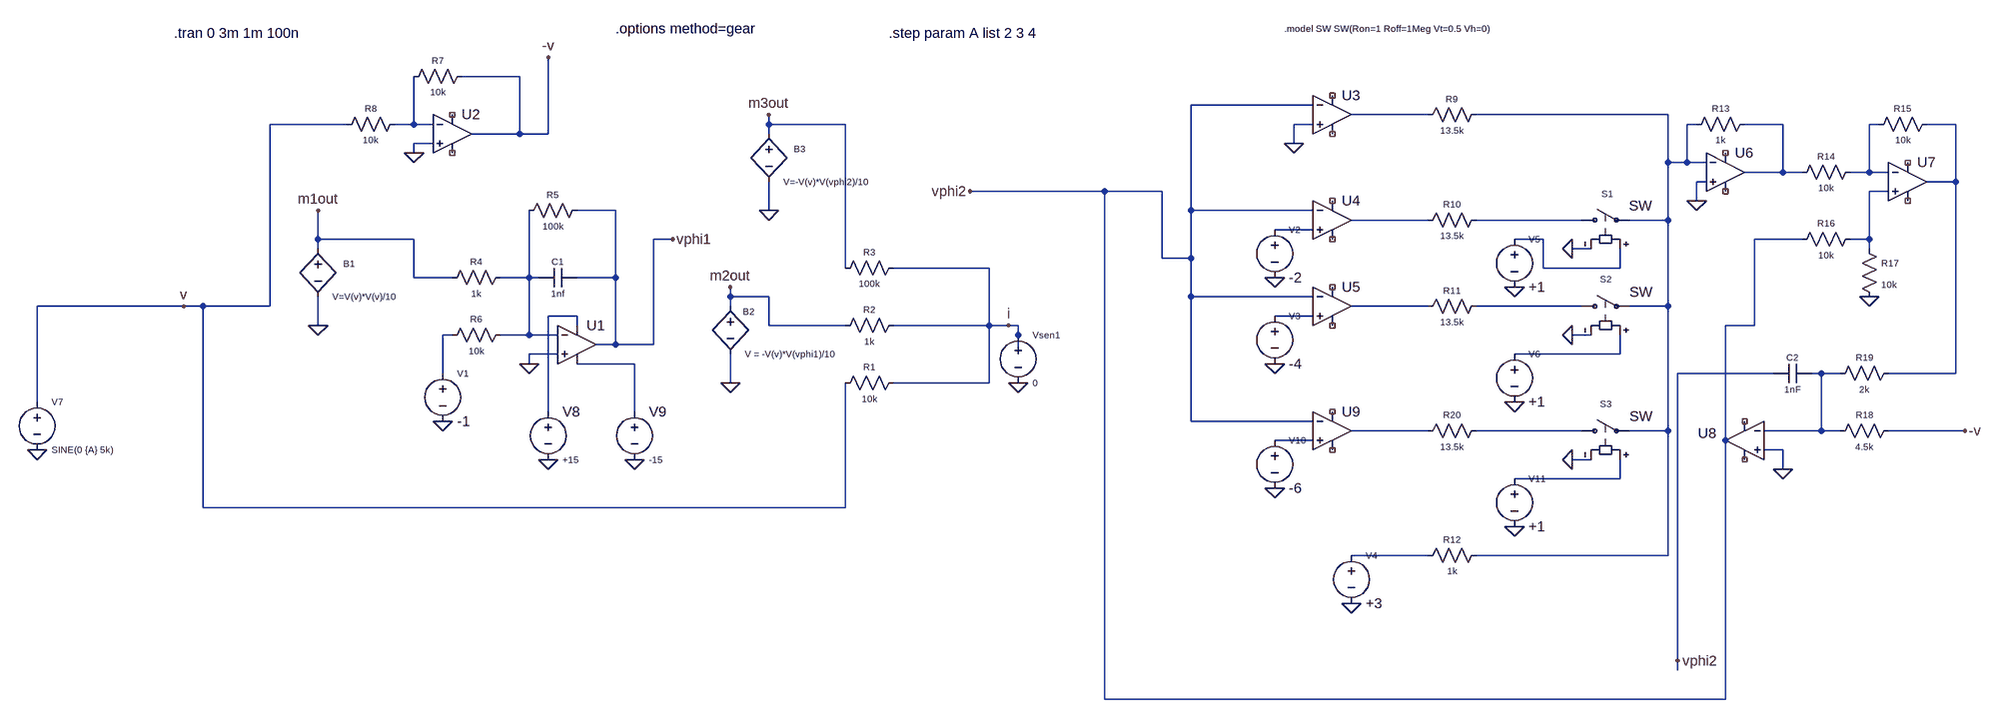
[diagram p0: schematic second_order_memregister.asc]
second_order_memregister.asc, the LTspice schematic file:
Version 4.1
SHEET 1 1848 700
WIRE -624 -352 -720 -352
WIRE 720 -304 496 -304
WIRE 912 -288 784 -288
WIRE 1312 -288 992 -288
WIRE -912 -272 -1040 -272
WIRE -800 -272 -800 -352
WIRE -800 -272 -832 -272
WIRE -768 -272 -800 -272
WIRE -208 -272 -208 -288
WIRE -80 -272 -208 -272
WIRE 720 -272 688 -272
WIRE 1360 -272 1344 -272
WIRE 1504 -272 1440 -272
WIRE 1664 -272 1648 -272
WIRE 1792 -272 1744 -272
WIRE -624 -256 -624 -352
WIRE -624 -256 -704 -256
WIRE -576 -256 -576 -384
WIRE -576 -256 -624 -256
WIRE -208 -256 -208 -272
WIRE -768 -240 -800 -240
WIRE 688 -240 688 -272
WIRE -800 -224 -800 -240
WIRE 1312 -208 1312 -288
WIRE 1344 -208 1344 -272
WIRE 1344 -208 1312 -208
WIRE 1376 -208 1344 -208
WIRE 1504 -192 1504 -272
WIRE 1504 -192 1440 -192
WIRE 1536 -192 1504 -192
WIRE 1648 -192 1648 -272
WIRE 1648 -192 1616 -192
WIRE 1680 -192 1648 -192
WIRE 1376 -176 1360 -176
WIRE 1792 -176 1792 -272
WIRE 1792 -176 1744 -176
WIRE 352 -160 128 -160
WIRE 448 -160 352 -160
WIRE 1680 -160 1648 -160
WIRE 1360 -144 1360 -176
WIRE -464 -128 -528 -128
WIRE -208 -128 -208 -176
WIRE 496 -128 496 -304
WIRE 720 -128 496 -128
WIRE 912 -112 784 -112
WIRE 1168 -112 992 -112
WIRE 1312 -112 1312 -208
WIRE 1312 -112 1248 -112
WIRE 720 -96 656 -96
WIRE -960 -80 -960 -128
WIRE -800 -80 -960 -80
WIRE -368 -80 -400 -80
WIRE 1104 -80 1056 -80
WIRE 1536 -80 1456 -80
WIRE 1648 -80 1648 -160
WIRE 1648 -80 1616 -80
WIRE -960 -64 -960 -80
WIRE 1184 -64 1152 -64
WIRE 1648 -64 1648 -80
WIRE 448 -48 448 -160
WIRE 496 -48 496 -128
WIRE 496 -48 448 -48
WIRE -80 -32 -80 -272
WIRE 160 -32 0 -32
WIRE 1104 -32 1104 -80
WIRE 1232 -32 1232 -64
WIRE 1232 -32 1104 -32
WIRE -800 -16 -800 -80
WIRE -736 -16 -800 -16
WIRE -608 -16 -608 -128
WIRE -608 -16 -656 -16
WIRE -592 -16 -608 -16
WIRE -464 -16 -464 -128
WIRE -464 -16 -528 -16
WIRE -272 16 -272 0
WIRE -208 16 -272 16
WIRE 496 16 496 -48
WIRE 720 16 496 16
WIRE -1184 32 -1472 32
WIRE -1152 32 -1184 32
WIRE -1040 32 -1040 -272
WIRE -1040 32 -1152 32
WIRE -272 32 -272 16
WIRE 912 32 784 32
WIRE 1168 32 992 32
WIRE 1312 32 1312 -112
WIRE 1312 32 1248 32
WIRE -528 48 -576 48
WIRE 720 48 656 48
WIRE -960 64 -960 16
WIRE -528 64 -528 48
WIRE -208 64 -208 16
WIRE -80 64 -208 64
WIRE 160 64 160 -32
WIRE 160 64 0 64
WIRE 192 64 160 64
WIRE 208 64 192 64
WIRE 1456 64 1456 -80
WIRE 1456 64 1408 64
WIRE -736 80 -752 80
WIRE -608 80 -608 -16
WIRE -608 80 -656 80
WIRE -560 80 -608 80
WIRE 208 80 208 64
WIRE 1184 80 1152 80
WIRE -464 96 -464 -16
WIRE -464 96 -496 96
WIRE -400 96 -400 -80
WIRE -400 96 -464 96
WIRE -560 112 -608 112
WIRE 208 112 208 80
WIRE 1232 112 1232 80
WIRE 1232 112 1056 112
WIRE -608 128 -608 112
WIRE -432 128 -528 128
WIRE -752 144 -752 80
WIRE 1488 144 1328 144
WIRE 1568 144 1552 144
WIRE 1600 144 1568 144
WIRE 1792 144 1792 -176
WIRE 1792 144 1680 144
WIRE -272 160 -272 112
WIRE -272 160 -288 160
WIRE 160 160 160 64
WIRE 160 160 0 160
WIRE -1472 192 -1472 32
WIRE -576 208 -576 48
WIRE -432 208 -432 128
WIRE 496 224 496 16
WIRE 720 224 496 224
WIRE 912 240 784 240
WIRE 1168 240 992 240
WIRE 1312 240 1312 32
WIRE 1312 240 1248 240
WIRE 1568 240 1568 144
WIRE 1568 240 1472 240
WIRE 1600 240 1568 240
WIRE 1808 240 1680 240
WIRE 720 256 656 256
WIRE 1408 256 1408 64
WIRE 1504 272 1472 272
WIRE 1184 288 1152 288
WIRE 1504 304 1504 272
WIRE 1232 320 1232 288
WIRE 1232 320 1056 320
WIRE -1152 368 -1152 32
WIRE -80 368 -80 160
WIRE -80 368 -1152 368
WIRE 912 448 784 448
WIRE 1312 448 1312 240
WIRE 1312 448 992 448
WIRE 1328 624 1328 144
WIRE 1328 640 1328 624
WIRE 352 688 352 -160
WIRE 1408 688 1408 256
WIRE 1408 688 352 688
FLAG 208 160 0
FLAG -608 128 0
FLAG -800 -224 0
FLAG -368 -80 vphi1
FLAG 128 -160 vphi2
FLAG 688 -240 0
FLAG 1360 -144 0
FLAG 1504 304 0
FLAG 1648 16 0
FLAG 1152 -64 0
FLAG 1152 80 0
FLAG -1184 32 v
FLAG -576 -384 -v
FLAG -752 224 0
FLAG 656 128 0
FLAG 656 -16 0
FLAG 784 528 0
FLAG 1056 0 0
FLAG 1056 192 0
FLAG -960 64 0
FLAG -960 -128 m1out
FLAG -272 160 0
FLAG -272 0 m2out
FLAG -208 -128 0
FLAG -208 -288 m3out
FLAG -1472 272 0
FLAG -576 288 0
FLAG -432 288 0
FLAG 192 64 i
FLAG 1152 288 0
FLAG 656 336 0
FLAG 1056 400 0
FLAG 1328 624 vphi2
FLAG 1808 240 -v
SYMBOL res 16 144 R90
WINDOW 0 0 56 VBottom 1
WINDOW 3 32 56 VTop 1
SYMATTR InstName R1
SYMATTR Value 10k
SYMBOL res 16 48 R90
WINDOW 0 0 56 VBottom 1
WINDOW 3 32 56 VTop 1
SYMATTR InstName R2
SYMATTR Value 1k
SYMBOL res 16 -48 R90
WINDOW 0 0 56 VBottom 1
WINDOW 3 32 56 VTop 1
SYMATTR InstName R3
SYMATTR Value 100k
SYMBOL res -640 -32 R90
WINDOW 0 0 56 VBottom 1
WINDOW 3 32 56 VTop 1
SYMATTR InstName R4
SYMATTR Value 1k
SYMBOL res -512 -144 R90
WINDOW 0 0 56 VBottom 1
WINDOW 3 32 56 VTop 1
SYMATTR InstName R5
SYMATTR Value 100k
SYMBOL cap -528 -32 R90
WINDOW 0 0 32 VBottom 1
WINDOW 3 32 32 VTop 1
SYMATTR InstName C1
SYMATTR Value 1nf
SYMBOL OpAmps\\UniversalOpAmp -528 96 R0
SYMATTR InstName U1
SYMBOL res -640 64 R90
WINDOW 0 0 56 VBottom 1
WINDOW 3 32 56 VTop 1
SYMATTR InstName R6
SYMATTR Value 10k
SYMBOL OpAmps\\UniversalOpAmp -736 -256 R0
SYMATTR InstName U2
SYMBOL res -704 -368 R90
WINDOW 0 0 56 VBottom 1
WINDOW 3 32 56 VTop 1
SYMATTR InstName R7
SYMATTR Value 10k
SYMBOL res -816 -288 R90
WINDOW 0 0 56 VBottom 1
WINDOW 3 32 56 VTop 1
SYMATTR InstName R8
SYMATTR Value 10k
SYMBOL voltage -752 128 R0
WINDOW 0 24 16 Left 1
SYMATTR InstName V1
SYMATTR Value -1
SYMBOL OpAmps\\UniversalOpAmp 752 -288 R0
SYMATTR InstName U3
SYMBOL OpAmps\\UniversalOpAmp 752 -112 R0
SYMATTR InstName U4
SYMBOL OpAmps\\UniversalOpAmp 752 32 R0
SYMATTR InstName U5
SYMBOL res 1008 -304 R90
WINDOW 0 0 56 VBottom 1
WINDOW 3 32 56 VTop 1
SYMATTR InstName R9
SYMATTR Value 13.5k
SYMBOL res 1008 -128 R90
WINDOW 0 0 56 VBottom 1
WINDOW 3 32 56 VTop 1
SYMATTR InstName R10
SYMATTR Value 13.5k
SYMBOL res 1008 16 R90
WINDOW 0 0 56 VBottom 1
WINDOW 3 32 56 VTop 1
SYMATTR InstName R11
SYMATTR Value 13.5k
SYMBOL sw 1152 -112 R270
WINDOW 0 44 49 VRight 1
WINDOW 3 24 95 VRight 2
SYMATTR InstName S1
SYMBOL sw 1152 32 R270
WINDOW 0 45 47 VRight 1
WINDOW 3 24 96 VRight 2
SYMATTR InstName S2
SYMBOL voltage 656 -112 R0
WINDOW 0 24 16 Left 1
SYMATTR InstName V2
SYMATTR Value -2
SYMBOL voltage 656 32 R0
WINDOW 0 24 16 Left 1
SYMATTR InstName V3
SYMATTR Value -4
SYMBOL res 1008 432 R90
WINDOW 0 0 56 VBottom 1
WINDOW 3 32 56 VTop 1
SYMATTR InstName R12
SYMATTR Value 1k
SYMBOL voltage 784 432 R0
WINDOW 0 24 16 Left 1
SYMATTR InstName V4
SYMATTR Value +3
SYMBOL OpAmps\\UniversalOpAmp 1408 -192 R0
SYMATTR InstName U6
SYMBOL OpAmps\\UniversalOpAmp 1712 -176 R0
SYMATTR InstName U7
SYMBOL OpAmps\\UniversalOpAmp 1440 256 M0
WINDOW 0 47 -12 Left 2
SYMATTR InstName U8
SYMBOL res 1456 -288 R90
WINDOW 0 0 56 VBottom 1
WINDOW 3 32 56 VTop 1
SYMATTR InstName R13
SYMATTR Value 1k
SYMBOL res 1632 -208 R90
WINDOW 0 0 56 VBottom 1
WINDOW 3 32 56 VTop 1
SYMATTR InstName R14
SYMATTR Value 10k
SYMBOL res 1760 -288 R90
WINDOW 0 0 56 VBottom 1
WINDOW 3 32 56 VTop 1
SYMATTR InstName R15
SYMATTR Value 10k
SYMBOL res 1632 -96 R90
WINDOW 0 0 56 VBottom 1
WINDOW 3 32 56 VTop 1
SYMATTR InstName R16
SYMATTR Value 10k
SYMBOL res 1632 -80 R0
WINDOW 0 36 40 Left 1
WINDOW 3 36 76 Left 1
SYMATTR InstName R17
SYMATTR Value 10k
SYMBOL res 1696 224 R90
WINDOW 0 0 56 VBottom 1
WINDOW 3 32 56 VTop 1
SYMATTR InstName R18
SYMATTR Value 4.5k
SYMBOL cap 1552 128 R90
WINDOW 0 0 32 VBottom 1
WINDOW 3 32 32 VTop 1
SYMATTR InstName C2
SYMATTR Value 1nF
SYMBOL res 1696 128 R90
WINDOW 0 0 56 VBottom 1
WINDOW 3 32 56 VTop 1
SYMATTR InstName R19
SYMATTR Value 2k
SYMBOL voltage 1056 -96 R0
WINDOW 0 24 16 Left 1
SYMATTR InstName V5
SYMATTR Value +1
SYMBOL voltage 1056 96 R0
WINDOW 0 24 16 Left 1
WINDOW 123 0 0 Left 0
WINDOW 39 0 0 Left 0
SYMATTR InstName V6
SYMATTR Value +1
SYMBOL voltage -1472 176 R0
WINDOW 0 24 16 Left 1
WINDOW 3 24 96 Left 1
SYMATTR InstName V7
SYMATTR Value SINE(0 {A} 5k)
SYMBOL bv -960 -80 R0
WINDOW 0 42 41 Left 1
WINDOW 3 24 96 Left 1
SYMATTR InstName B1
SYMATTR Value V=V(v)*V(v)/10
SYMBOL bv -272 16 R0
WINDOW 0 21 25 Left 1
WINDOW 3 24 96 Left 1
SYMATTR InstName B2
SYMATTR Value V = -V(v)*V(vphi1)/10
SYMBOL bv -208 -272 R0
WINDOW 0 42 41 Left 1
WINDOW 3 24 96 Left 1
SYMATTR InstName B3
SYMATTR Value V=-V(v)*V(vphi2)/10
SYMBOL voltage -576 192 R0
WINDOW 3 24 96 Left 1
SYMATTR Value +15
SYMATTR InstName V8
SYMBOL voltage -432 192 R0
WINDOW 3 24 96 Left 1
SYMATTR Value -15
SYMATTR InstName V9
SYMBOL voltage 208 64 R0
WINDOW 0 24 16 Left 1
WINDOW 3 24 96 Left 1
SYMATTR InstName Vsen1
SYMATTR Value 0
SYMBOL OpAmps\\UniversalOpAmp 752 240 R0
SYMATTR InstName U9
SYMBOL res 1008 224 R90
WINDOW 0 0 56 VBottom 1
WINDOW 3 32 56 VTop 1
SYMATTR InstName R20
SYMATTR Value 13.5k
SYMBOL sw 1152 240 R270
WINDOW 0 45 47 VRight 1
WINDOW 3 24 96 VRight 2
SYMATTR InstName S3
SYMBOL voltage 656 240 R0
WINDOW 0 24 16 Left 1
SYMATTR InstName V10
SYMATTR Value -6
SYMBOL voltage 1056 304 R0
WINDOW 0 24 16 Left 1
WINDOW 123 0 0 Left 0
WINDOW 39 0 0 Left 0
SYMATTR InstName V11
SYMATTR Value +1
TEXT -1200 -424 Left 2 !.tran 0 3m 1m 100n
TEXT 672 -432 Left 1 !.model SW SW(Ron=1 Roff=1Meg Vt=0.5 Vh=0)
TEXT -464 -432 Left 2 !.options method=gear
TEXT -8 -424 Left 2 !.step param A list 2 3 4

The netlist it stands for:
* second_order_memregister.asc
R1 i v 10k
R2 i m2out 1k
R3 i m3out 100k
R4 N012 m1out 1k
R5 vphi1 N012 100k
C1 vphi1 N012 1nf
X§U1 0 N012 N015 N019 vphi1 level1 Avol=1Meg GBW=10Meg Vos=0 En=0 Enk=0 In=0 Ink=0 Rin=500Meg  ; pins In+ In- V+ V- OUT
R6 N012 N017 10k
X§U2 0 N003 NC_01 NC_02 -v level1 Avol=1Meg GBW=10Meg Vos=0 En=0 Enk=0 In=0 Ink=0 Rin=500Meg  ; pins In+ In- V+ V- OUT
R7 -v N003 10k
R8 N003 v 10k
V1 N017 0 -1
X§U3 0 vphi2 NC_03 NC_04 N001 level1 Avol=1Meg GBW=10Meg Vos=0 En=0 Enk=0 In=0 Ink=0 Rin=500Meg  ; pins In+ In- V+ V- OUT
X§U4 N010 vphi2 NC_05 NC_06 N008 level1 Avol=1Meg GBW=10Meg Vos=0 En=0 Enk=0 In=0 Ink=0 Rin=500Meg  ; pins In+ In- V+ V- OUT
X§U5 N016 vphi2 NC_07 NC_08 N013 level1 Avol=1Meg GBW=10Meg Vos=0 En=0 Enk=0 In=0 Ink=0 Rin=500Meg  ; pins In+ In- V+ V- OUT
R9 N002 N001 13.5k
R10 N009 N008 13.5k
R11 N014 N013 13.5k
S1 N009 N002 N011 0 SW
S2 N014 N002 N018 0 SW
V2 N010 0 -2
V3 N016 0 -4
R12 N002 N025 1k
V4 N025 0 +3
X§U6 0 N002 NC_09 NC_10 N004 level1 Avol=1Meg GBW=10Meg Vos=0 En=0 Enk=0 In=0 Ink=0 Rin=500Meg  ; pins In+ In- V+ V- OUT
X§U7 N007 N005 NC_11 NC_12 N006 level1 Avol=1Meg GBW=10Meg Vos=0 En=0 Enk=0 In=0 Ink=0 Rin=500Meg  ; pins In+ In- V+ V- OUT
X§U8 0 N020 NC_13 NC_14 vphi2 level1 Avol=1Meg GBW=10Meg Vos=0 En=0 Enk=0 In=0 Ink=0 Rin=500Meg  ; pins In+ In- V+ V- OUT
R13 N004 N002 1k
R14 N005 N004 10k
R15 N006 N005 10k
R16 N007 vphi2 10k
R17 N007 0 10k
R18 -v N020 4.5k
C2 N020 vphi2 1nF
R19 N006 N020 2k
V5 N011 0 +1
V6 N018 0 +1
V7 v 0 SINE(0 {A} 5k)
B1 m1out 0 V=V(v)*V(v)/10
B2 m2out 0 V = -V(v)*V(vphi1)/10
B3 m3out 0 V=-V(v)*V(vphi2)/10
V8 N015 0 +15
V9 N019 0 -15
Vsen1 i 0 0
X§U9 N023 vphi2 NC_15 NC_16 N021 level1 Avol=1Meg GBW=10Meg Vos=0 En=0 Enk=0 In=0 Ink=0 Rin=500Meg  ; pins In+ In- V+ V- OUT
R20 N022 N021 13.5k
S3 N022 N002 N024 0 SW
V10 N023 0 -6
V11 N024 0 +1
.tran 0 3m 1m 100n
.model SW SW(Ron=1 Roff=1Meg Vt=0.5 Vh=0)
.options method=gear
.step param A list 2 3 4
.lib UniversalOpAmp1.lib
.backanno
.end